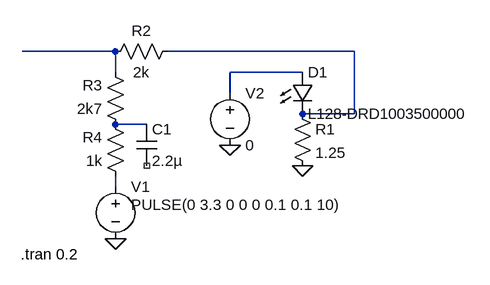
[diagram p0: schematic FP7102.asc]
FP7102.asc, the LTspice schematic file:
Version 4
SHEET 1 880 680
WIRE 304 -64 160 -64
WIRE 672 -64 384 -64
WIRE 304 -32 304 -64
WIRE 592 -32 480 -32
WIRE 480 0 480 -32
WIRE 672 32 672 -64
WIRE 672 32 592 32
WIRE 352 48 304 48
WIRE 304 144 304 128
FLAG 592 112 0
FLAG 480 80 0
FLAG 304 224 0
SYMBOL res 576 16 R0
SYMATTR InstName R1
SYMATTR Value 1.25
SYMBOL res 400 -80 R90
WINDOW 0 0 56 VBottom 2
WINDOW 3 32 56 VTop 2
SYMATTR InstName R2
SYMATTR Value 2k
SYMBOL res 320 64 R180
WINDOW 0 36 76 Left 2
WINDOW 3 36 40 Left 2
SYMATTR InstName R3
SYMATTR Value 2k7
SYMATTR SpiceLine tol=5
SYMBOL res 320 144 R180
WINDOW 0 36 76 Left 2
WINDOW 3 36 40 Left 2
SYMATTR InstName R4
SYMATTR Value 1k
SYMBOL cap 336 48 R0
SYMATTR InstName C1
SYMATTR Value 2.2µ
SYMBOL LED 576 -32 R0
SYMATTR InstName D1
SYMATTR Value L128-DRD1003500000
SYMBOL voltage 304 128 R0
WINDOW 3 24 44 Left 2
WINDOW 123 0 0 Left 0
WINDOW 39 0 0 Left 0
SYMATTR InstName V1
SYMATTR Value PULSE(0 3.3 0 0 0 0.1 0.1 10)
SYMBOL voltage 480 -16 R0
WINDOW 123 0 0 Left 0
WINDOW 39 0 0 Left 0
SYMATTR InstName V2
SYMATTR Value 0
TEXT 158 248 Left 2 !.tran 0.2

The netlist it stands for:
* FP7102.asc
R1 N002 0 1.25
R2 N002 N001 2k
R3 N004 N001 2k7 tol=5
R4 N005 N004 1k
C1 N004 NC_01 2.2µ
D1 N003 N002 L128-DRD1003500000
V1 N005 0 PULSE(0 3.3 0 0 0 0.1 0.1 10)
V2 N003 0 0
.model D D
.lib standard.dio
.tran 0.2
.backanno
.end